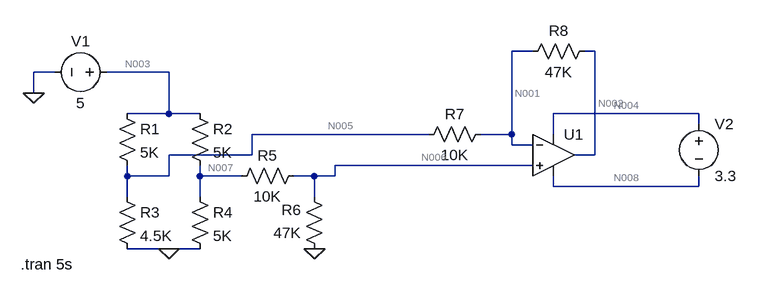
[diagram p0: schematic suspenson.asc]
suspenson.asc, the LTspice schematic file:
Version 4
SHEET 1 1040 680
WIRE 720 -48 688 -48
WIRE 816 -48 800 -48
WIRE -16 -16 -48 -16
WIRE 160 -16 64 -16
WIRE -48 16 -48 -16
WIRE 160 48 160 -16
WIRE 160 48 96 48
WIRE 208 48 160 48
WIRE 976 48 752 48
WIRE 976 64 976 48
WIRE 560 80 288 80
WIRE 688 80 688 -48
WIRE 688 80 640 80
WIRE 752 80 752 48
WIRE 688 96 688 80
WIRE 720 96 688 96
WIRE 288 112 288 80
WIRE 288 112 160 112
WIRE 816 112 816 -48
WIRE 816 112 784 112
WIRE 720 128 416 128
WIRE 96 144 96 128
WIRE 160 144 160 112
WIRE 160 144 96 144
WIRE 208 144 208 128
WIRE 272 144 208 144
WIRE 384 144 352 144
WIRE 416 144 416 128
WIRE 416 144 384 144
WIRE 752 160 752 144
WIRE 976 160 976 144
WIRE 976 160 752 160
WIRE 96 176 96 144
WIRE 208 176 208 144
WIRE 384 176 384 144
WIRE 160 256 96 256
WIRE 208 256 160 256
FLAG 160 256 0
FLAG -48 16 0
FLAG 384 256 0
SYMBOL res 80 32 R0
SYMATTR InstName R1
SYMATTR Value 5K
SYMATTR SpiceLine tol=1 pwr=0.1
SYMBOL res 192 32 R0
SYMATTR InstName R2
SYMATTR Value 5K
SYMATTR SpiceLine tol=1 pwr=0.1
SYMBOL res 80 160 R0
SYMATTR InstName R3
SYMATTR Value 4.5K
SYMATTR SpiceLine tol=1 pwr=0.1
SYMBOL res 192 160 R0
SYMATTR InstName R4
SYMATTR Value 5K
SYMATTR SpiceLine tol=1 pwr=0.1
SYMBOL voltage 80 -16 R90
WINDOW 0 -32 56 VBottom 2
WINDOW 3 32 56 VTop 2
WINDOW 123 0 0 Left 0
WINDOW 39 0 0 Left 0
SYMATTR InstName V1
SYMATTR Value 5
SYMBOL res 368 128 R90
WINDOW 0 0 56 VBottom 2
WINDOW 3 32 56 VTop 2
SYMATTR InstName R5
SYMATTR Value 10K
SYMBOL res 400 272 R180
WINDOW 0 36 76 Left 2
WINDOW 3 36 40 Left 2
SYMATTR InstName R6
SYMATTR Value 47K
SYMBOL OpAmps\\UniversalOpamp 752 112 R0
SYMATTR InstName U1
SYMBOL res 656 64 R90
WINDOW 0 0 56 VBottom 2
WINDOW 3 32 56 VTop 2
SYMATTR InstName R7
SYMATTR Value 10K
SYMBOL res 816 -64 R90
WINDOW 0 0 56 VBottom 2
WINDOW 3 32 56 VTop 2
SYMATTR InstName R8
SYMATTR Value 47K
SYMBOL voltage 976 48 R0
WINDOW 123 0 0 Left 0
WINDOW 39 0 0 Left 0
SYMATTR InstName V2
SYMATTR Value 3.3
TEXT -68 280 Left 2 !.tran 5s

The netlist it stands for:
* suspenson.asc
R1 N003 N005 5K tol=1 pwr=0.1
R2 N003 N007 5K tol=1 pwr=0.1
R3 N005 0 4.5K tol=1 pwr=0.1
R4 N007 0 5K tol=1 pwr=0.1
V1 N003 0 5
R5 N006 N007 10K
R6 0 N006 47K
XU1 N006 N001 N004 N008 N002 level1 Avol=1Meg GBW=10Meg Vos=0 En=0 Enk=0 In=0 Ink=0 Rin=500Meg  ; pins In+ In- V+ V- OUT
R7 N001 N005 10K
R8 N002 N001 47K
V2 N004 N008 3.3
.tran 5s
.lib UniversalOpAmp1.lib
.backanno
.end

* Results of the author's LTspice run, read from the files saved beside the schematic
* Operating Point, zero values left out:
*   V(n003) = 5 V
*   V(n005) = 2.293 V
*   V(n007) = 2.395 V
*   V(n006) = 1.975 V
*   V(n001) = 1.975 V
*   V(n002) = 479 mV
*   V(n004) = 3.625 V
*   V(n008) = 324.8 mV
*   I(R8) = -31.83 µA
*   I(R7) = -31.83 µA
*   I(R6) = -42.02 µA
*   I(R5) = -42.02 µA
*   I(R4) = 479 µA
*   I(R3) = 509.6 µA
*   I(R2) = 521 µA
*   I(R1) = 541.4 µA
*   I(V2) = -3.3 nA
*   I(V1) = -1.062 mA
*   Ix(u1:3) = 3.3 nA
*   Ix(u1:4) = -3.3 nA
*   Ix(u1:5) = 31.83 µA